# EAGLE schematic electronics_pom (EAGLE 6.4)
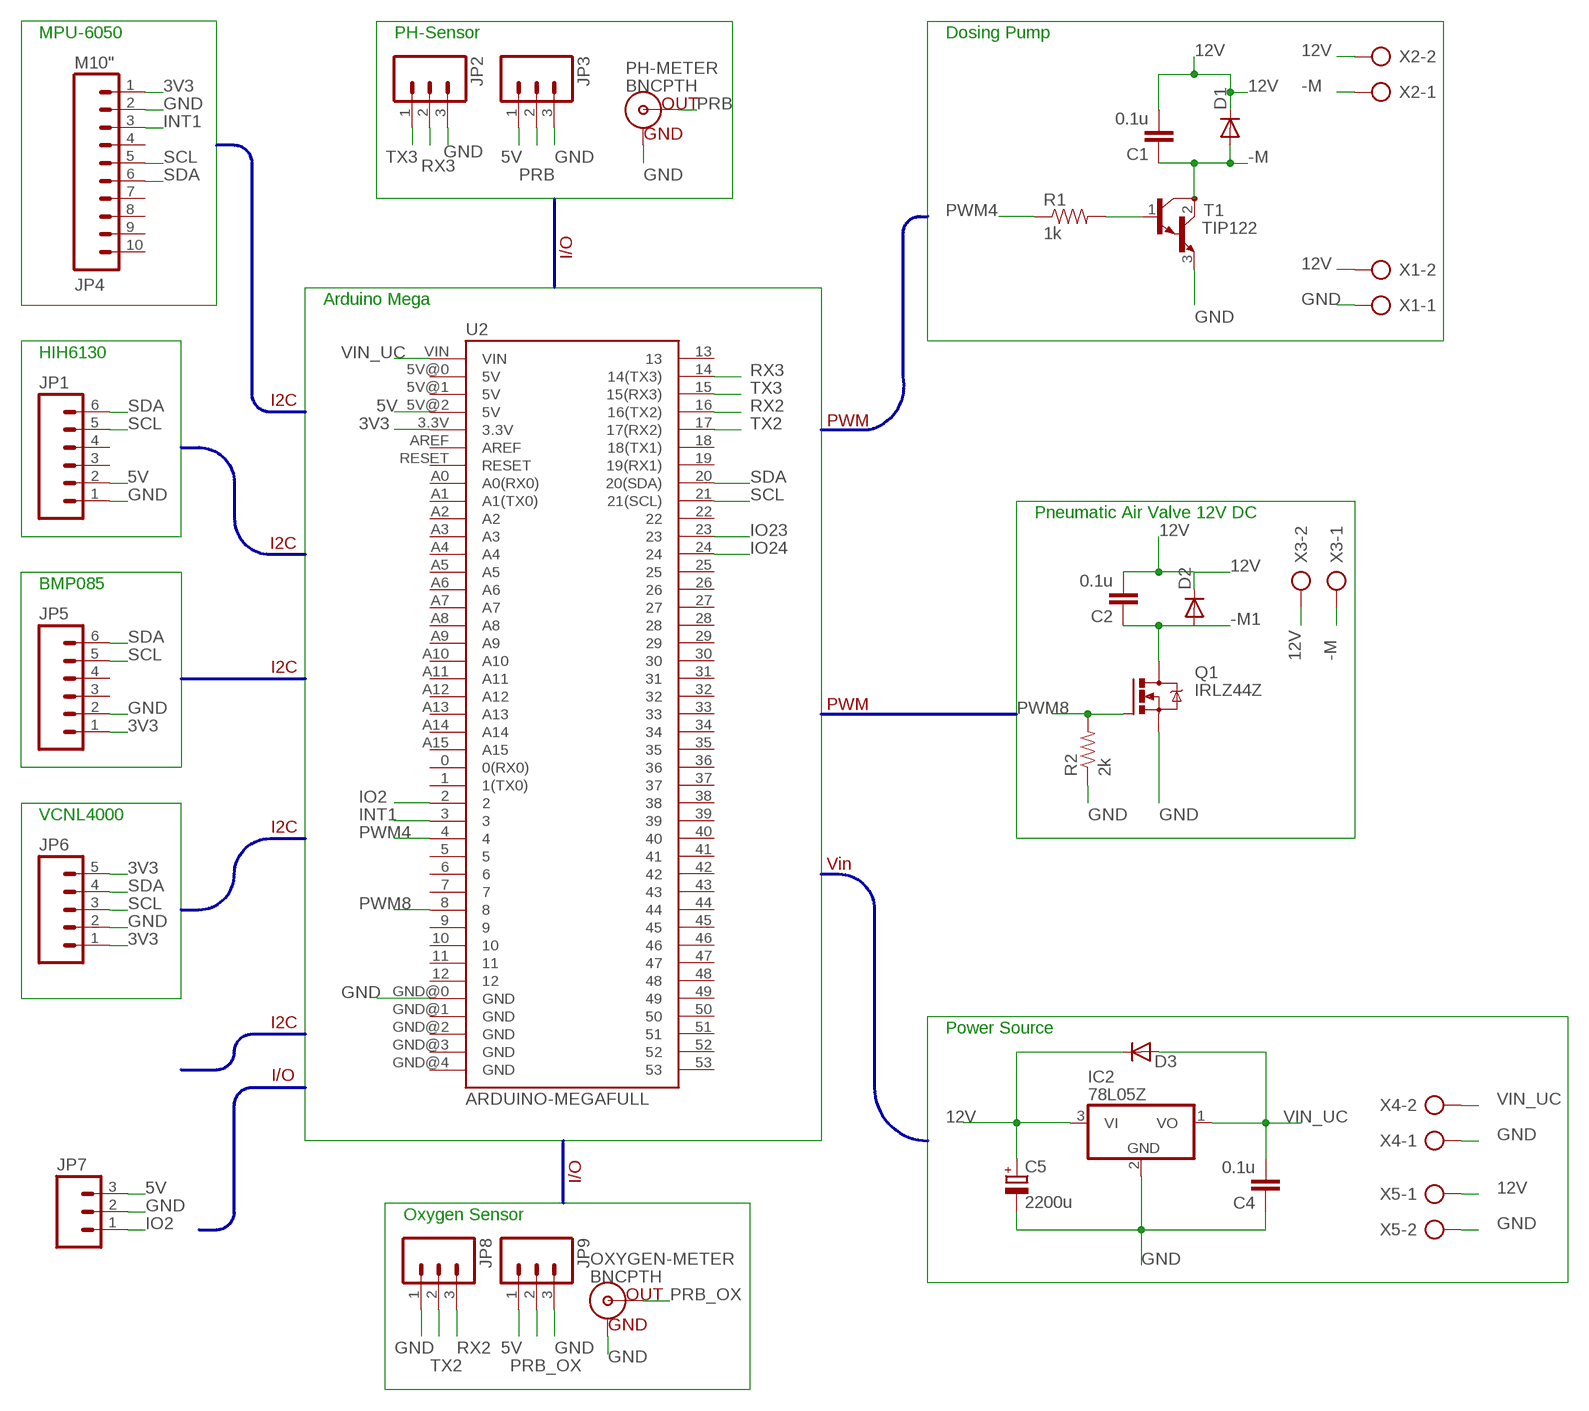
[diagram p0: schematic, sheet 1]

## Parts
C1  0.1u  CAPPTH  [CAP-PTH-SMALL]
C2  0.1u  CAPPTH  [CAP-PTH-SMALL]
C4  0.1u  CAPPTH  [CAP-PTH-SMALL]
C5  2200u  CPOL-EUE5-13  [E5-13]
D1  DIODEPTH  [DIODE-1N4001]
D2  DIODEPTH  [DIODE-1N4001]
D3  DIODEPTH  [DIODE-1N4001]
IC2  78L05Z  [TO92]
JP1  M06LONGPADS  [1X06_LONGPADS]
JP2  M03LONGPADS  [1X03_LONGPADS]
JP3  M03LONGPADS  [1X03_LONGPADS]
JP4  M10"  [1X10]
JP5  M06LONGPADS  [1X06_LONGPADS]
JP6  M05PTH_LONGPADS  [1X05_LONGPADS]
JP7  M03LONGPADS  [1X03_LONGPADS]
JP8  M03LONGPADS  [1X03_LONGPADS]
JP9  M03LONGPADS  [1X03_LONGPADS]
OXYGEN-METER  BNCPTH  [BNC]
PH-METER  BNCPTH  [BNC]
Q1  IRLZ44Z  [TO220BH]
R1  1k  RESISTORPTH-1/4W  [AXIAL-0.4]
R2  2k  RESISTORPTH-1/4W  [AXIAL-0.4]
T1  TIP122  [TO220]
U2  ARDUINO-MEGAFULL  [ARDUINO_MEGA]
X1  AK500/2  [AK500/2]
X2  AK500/2  [AK500/2]
X3  AK500/2  [AK500/2]
X4  AK500/2  [AK500/2]
X5  AK500/2  [AK500/2]

## Nets
3V3: JP4.1 JP5.1 JP6.1 JP6.5 U2.3.3V
5V: JP1.2 JP3.1 JP7.3 JP9.1 U2.5V@2(5V)
12V: C1.2 C2.2 C5.+ D1.C D2.C D3.C IC2.3(VI) X1.2 X2.2 X3.2 X5.1
-M: C1.1 D1.A T1.2(C) X2.1 X3.1
-M1: C2.1 D2.A Q1.D
GND: C4.1 C5.- IC2.2(GND) JP1.1 JP2.3 JP3.3 JP4.2 JP5.2 JP6.2 JP7.2 JP8.1 JP9.3 OXYGEN-METER.GND PH-METER.GND Q1.S R2.P$1 T1.3(E) U2.GND@0(GND) X1.1 X4.1 X5.2
INT1: JP4.3 U2.3
IO2: JP7.1 U2.2
IO23: U2.23
IO24: U2.24
N$11: R1.P$2 T1.1(B)
PRB: JP3.2 PH-METER.S(OUT)
PRB_OX: JP9.2 OXYGEN-METER.S(OUT)
PWM4: R1.P$1 U2.4
PWM8: Q1.G R2.P$2 U2.8
RX2: JP8.3 U2.16(16(TX2))
RX3: JP2.2 U2.14(14(TX3))
SCL: JP1.5 JP4.5 JP5.5 JP6.3 U2.21(21(SCL))
SDA: JP1.6 JP4.6 JP5.6 JP6.4 U2.20(20(SDA))
TX2: JP8.2 U2.17(17(RX2))
TX3: JP2.1 U2.15(15(RX3))
VIN_UC: C4.2 D3.A IC2.1(VO) U2.VIN X4.2
Unconnected: JP1.3 JP1.4 JP4.4 JP4.7 JP4.8 JP4.9 JP4.10 JP5.3 JP5.4 U2.0(0(RX0)) U2.1(1(TX0)) U2.5 U2.5V@0(5V) U2.5V@1(5V) U2.6 U2.7 U2.9 U2.10 U2.11 U2.12 U2.13 U2.18(18(TX1)) U2.19(19(RX1)) U2.22 U2.25 U2.26 U2.27 U2.28 U2.29 U2.30 U2.31 U2.32 U2.33 U2.34 U2.35 U2.36 U2.37 U2.38 U2.39 U2.40 U2.41 U2.42 U2.43 U2.44 U2.45 U2.46 U2.47 U2.48 U2.49 U2.50 U2.51 U2.52 U2.53 U2.A0(A0(RX0)) U2.A1(A1(TX0)) U2.A2 U2.A3 U2.A4 U2.A5 U2.A6 U2.A7 U2.A8 U2.A9 U2.A10 U2.A11 U2.A12 U2.A13 U2.A14 U2.A15 U2.AREF U2.GND@1(GND) U2.GND@2(GND) U2.GND@3(GND) U2.GND@4(GND) U2.RESET

## Buses
B$2
B$3
B$5
B$1
B$7
B$4
B$6
B$8
B$9
B$10
B$11

## Notes on the sheet
- MPU-6050 | PH-Sensor | Dosing Pump
- I/O
- Arduino Mega
- HIH6130
- I2C
- PWM
- Pneumatic Air Valve 12V DC
- I2C
- BMP085
- I2C
- PWM
- VCNL4000
- I2C
- Vin
- I2C
- Power Source
- EC-Meter sensor
- I/O
- Radiation Sensor
- I/O
- Oxygen Sensor

## Library data of the parts
C1 C2 C4 = SparkFun-Capacitors:CAP: Capacitor Standard 0603 ceramic capacitor, and 0.1" leaded capacitor.
C5 = rcl:CPOL-EU: POLARIZED CAPACITOR, European symbol
D1-D3 = SparkFun-DiscreteSemi:DIODE: Diode These are standard reverse protection diodes and small signal diodes. SMA package can handle up to about 1A. SOD-323 can handle about 200mA. What the SOD-323 package when ordering, there are some mfgs out there that are 5-pin packages.
IC2 = linear:78*: Positive VOLTAGE REGULATOR Source: http://cache.national.com/ds/LM/LM78L05.pdf http://www.fairchildsemi.com/ds/LM/LM7805.pdf
JP1 JP5 = SparkFun-Connectors:M06: Header 6 Standard 6-pin 0.1" header. Use with straight break away headers (SKU : PRT-00116), right angle break away headers (PRT-00553), swiss pins (PRT-00743), machine pins (PRT-00117), and female headers (PRT-00115). Molex polarized connector foot print use with SKU : PRT-08094 with associated crimp pins and housings. NOTES ON THE VARIANTS LOCK and LOCK_LONGPADS... This footprint was designed to help hold the alignment of a through-hole component (i.e. 6-pin header) while soldering it into place. You may notice that each hole has been shifted either up or down by 0.005 of an inch from it's more standard position (which is a perfectly straight line). This slight alteration caused the pins (the squares in the middle) to touch the edges of the holes. Because they are alternating, it causes a "brace" to hold the component in place. 0.005 has proven to be the perfect amount of "off-center" position when using our standard breakaway headers. Although looks a little odd when you look at the bare footprint, once you have a header in there, the alteration is very hard to notice. Also, if you push a header all the way into place, it is covered up entirely on the bottom side. This idea of altering the position of holes to aid alignment will be further integrated into the Sparkfun Library for other footprints. It can help hold any component with 3 or more connection pins.
JP2 JP3 JP7-JP9 = SparkFun-Connectors:M03: Header 3 Standard 3-pin 0.1" header. Use with straight break away headers (SKU : PRT-00116), right angle break away headers (PRT-00553), swiss pins (PRT-00743), machine pins (PRT-00117), and female headers (PRT-00115). Molex polarized connector foot print use with SKU : PRT-08232 with associated crimp pins and housings.
JP4 = SparkFun-Connectors:M10: Header 10 Standard 10-pin 0.1" header. Use with straight break away headers (SKU : PRT-00116), right angle break away headers (PRT-00553), swiss pins (PRT-00743), machine pins (PRT-00117), and female headers (PRT-00115).
JP6 = SparkFun-Connectors:M05: Header 5 Standard 5-pin 0.1" header. Use with straight break away headers (SKU : PRT-00116), right angle break away headers (PRT-00553), swiss pins (PRT-00743), machine pins (PRT-00117), and female headers (PRT-00115). Molex polarized connector foot print use with SKU : PRT-08230 with associated crimp pins and housings.
OXYGEN-METER PH-METER = SparkFun-Connectors:BNC: BNC Connector, Mouser Part# 5227161
Q1 = transistor-power:IRLZ44Z: N-Channel HEXFET® Power MOSFET Logic Level AUTOMOTIVE MOSFET Source: http://www.irf.com/product-info/datasheets/data/irlz44zpbf.pdf
R1 R2 = SparkFun-Passives:RESISTOR: Resistor Basic schematic elements and footprints for 0603, 1206, and PTH resistors.
T1 = transistor-neu-to92:TIP122: NPN BIPOLAR DARLINGTON TRANSISTOR
U2 = SparkFun-Boards:ARDUINO-MEGA: Arduino Mega board footprint
X1-X5 = con-ptr500:AK500/2: CONNECTOR; OC_FARNELL: unknown; OC_NEWARK: unknown